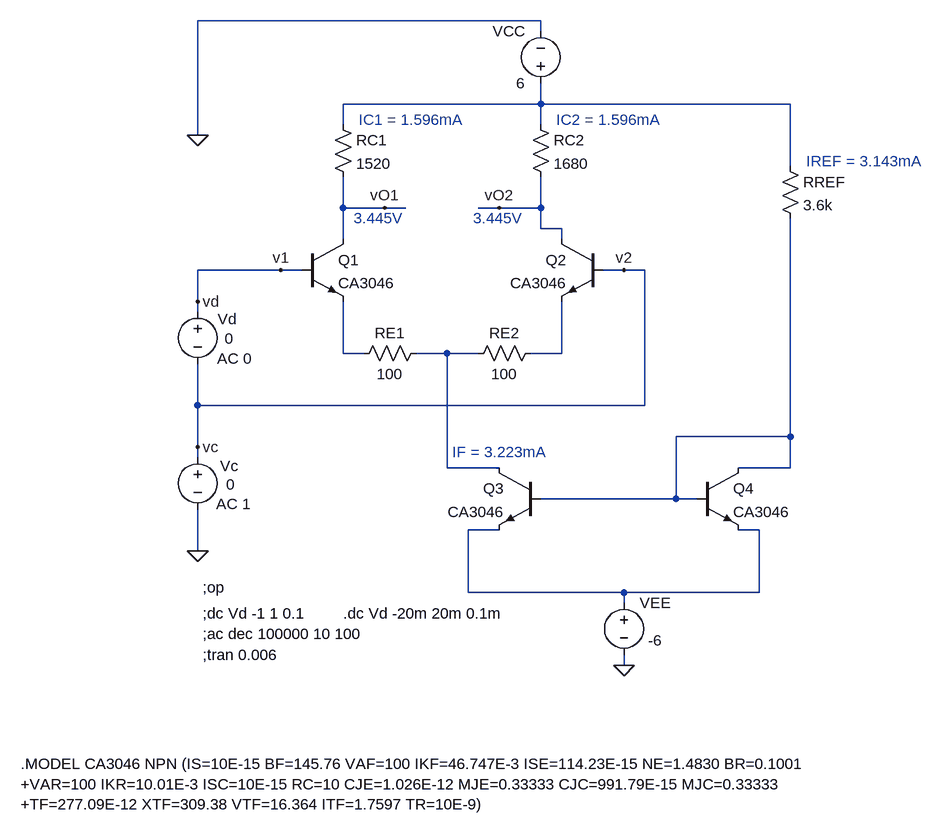
[diagram p0: schematic lab2.asc]
lab2.asc, the LTspice schematic file:
Version 4
SHEET 1 1268 964
WIRE 512 -320 -16 -320
WIRE 512 -304 512 -320
WIRE 512 -192 512 -224
WIRE 512 -192 208 -192
WIRE 896 -192 512 -192
WIRE 208 -160 208 -192
WIRE 512 -160 512 -192
WIRE -16 -144 -16 -320
WIRE 896 -96 896 -192
WIRE 208 -32 208 -80
WIRE 272 -32 208 -32
WIRE 304 -32 272 -32
WIRE 448 -32 416 -32
WIRE 512 -32 512 -80
WIRE 512 -32 448 -32
WIRE 512 0 512 -32
WIRE 544 0 512 0
WIRE 208 16 208 -32
WIRE 544 16 544 0
WIRE 112 64 -16 64
WIRE 144 64 112 64
WIRE 640 64 608 64
WIRE 672 64 640 64
WIRE -16 112 -16 64
WIRE -16 128 -16 112
WIRE 208 192 208 112
WIRE 240 192 208 192
WIRE 368 192 320 192
WIRE 416 192 368 192
WIRE 544 192 544 112
WIRE 544 192 496 192
WIRE -16 272 -16 208
WIRE 672 272 672 64
WIRE 672 272 -16 272
WIRE 896 320 896 -16
WIRE 896 320 720 320
WIRE -16 336 -16 272
WIRE -16 352 -16 336
WIRE 368 368 368 192
WIRE 448 368 368 368
WIRE 896 368 896 320
WIRE 896 368 816 368
WIRE 720 416 720 320
WIRE 720 416 512 416
WIRE 752 416 720 416
WIRE 448 464 400 464
WIRE 848 464 816 464
WIRE -16 496 -16 432
WIRE 400 560 400 464
WIRE 640 560 400 560
WIRE 848 560 848 464
WIRE 848 560 640 560
WIRE 640 576 640 560
WIRE 640 672 640 656
FLAG -16 496 0
FLAG 640 672 0
FLAG -16 -144 0
FLAG 272 -32 vO1
FLAG 448 -32 vO2
FLAG 112 64 v1
FLAG 640 64 v2
FLAG -16 112 vd
FLAG -16 336 vc
SYMBOL voltage -16 336 R0
WINDOW 3 44 58 Left 2
WINDOW 0 35 29 Left 2
WINDOW 123 29 88 Left 2
WINDOW 39 0 0 Left 0
SYMATTR Value 0
SYMATTR InstName Vc
SYMATTR Value2 AC 1
SYMBOL voltage -16 112 R0
WINDOW 3 42 57 Left 2
WINDOW 0 31 27 Left 2
WINDOW 123 30 88 Left 2
WINDOW 39 0 0 Left 0
SYMATTR Value 0
SYMATTR InstName Vd
SYMATTR Value2 AC 0
SYMBOL voltage 640 560 R0
WINDOW 3 37 74 Left 2
SYMATTR Value -6
SYMATTR InstName VEE
SYMBOL voltage 512 -208 R180
WINDOW 0 24 96 Left 2
WINDOW 3 24 16 Left 2
WINDOW 123 0 0 Left 0
WINDOW 39 0 0 Left 0
SYMATTR InstName VCC
SYMATTR Value 6
SYMBOL npn 144 16 R0
SYMATTR InstName Q1
SYMATTR Value CA3046
SYMBOL npn 608 16 M0
SYMATTR InstName Q2
SYMATTR Value CA3046
SYMBOL npn 512 368 M0
SYMATTR InstName Q3
SYMATTR Value CA3046
SYMBOL npn 752 368 R0
SYMATTR InstName Q4
SYMATTR Value CA3046
SYMBOL res 192 -176 R0
SYMATTR InstName RC1
SYMATTR Value 1520
SYMBOL res 496 -176 R0
SYMATTR InstName RC2
SYMATTR Value 1680
SYMBOL res 880 -112 R0
SYMATTR InstName RREF
SYMATTR Value 3.6k
SYMBOL res 336 176 R90
WINDOW 0 0 56 VBottom 2
WINDOW 3 32 56 VTop 2
SYMATTR InstName RE1
SYMATTR Value 100
SYMBOL res 512 176 R90
WINDOW 0 0 56 VBottom 2
WINDOW 3 32 56 VTop 2
SYMATTR InstName RE2
SYMATTR Value 100
TEXT -288 824 Left 2 !.MODEL CA3046 NPN (IS=10E-15 BF=145.76 VAF=100 IKF=46.747E-3 ISE=114.23E-15 NE=1.4830 BR=0.1001\n+VAR=100 IKR=10.01E-3 ISC=10E-15 RC=10 CJE=1.026E-12 MJE=0.33333 CJC=991.79E-15 MJC=0.33333\n+TF=277.09E-12 XTF=309.38 VTF=16.364 ITF=1.7597 TR=10E-9)
TEXT -8 552 Left 2 !;op
TEXT -8 592 Left 2 !;dc Vd -1 1 0.1
TEXT -8 624 Left 2 !;ac dec 100000 10 100
TEXT -8 656 Left 2 !;tran 0.006
TEXT 376 344 Left 2 ;IF = 3.223mA
TEXT 536 -168 Left 2 ;IC2 = 1.596mA
TEXT 232 -168 Left 2 ;IC1 = 1.596mA
TEXT 920 -104 Left 2 ;IREF = 3.143mA
TEXT 224 -16 Left 2 ;3.445V
TEXT 408 -16 Left 2 ;3.445V
TEXT 208 592 Left 2 !.dc Vd -20m 20m 0.1m

The netlist it stands for:
* lab2.asc
Vc vc 0 0 AC 1
Vd vd vc 0 AC 0
VEE N006 0 -6
VCC N001 0 6
Q1 vO1 vd N002 0 CA3046
Q2 vO2 vc N004 0 CA3046
Q3 N003 N005 N006 0 CA3046
Q4 N005 N005 N006 0 CA3046
RC1 N001 vO1 1520
RC2 N001 vO2 1680
RREF N001 N005 3.6k
RE1 N003 N002 100
RE2 N004 N003 100
.model NPN NPN
.model PNP PNP
.lib standard.bjt
.MODEL CA3046 NPN (IS=10E-15 BF=145.76 VAF=100 IKF=46.747E-3 ISE=114.23E-15 NE=1.4830 BR=0.1001
+VAR=100 IKR=10.01E-3 ISC=10E-15 RC=10 CJE=1.026E-12 MJE=0.33333 CJC=991.79E-15 MJC=0.33333
+TF=277.09E-12 XTF=309.38 VTF=16.364 ITF=1.7597 TR=10E-9)
;op
;dc Vd -1 1 0.1
;ac dec 100000 10 100
;tran 0.006
* IF = 3.223mA
* IC2 = 1.596mA
* IC1 = 1.596mA
* IREF = 3.143mA
* 3.445V
* 3.445V
.dc Vd -20m 20m 0.1m
.backanno
.end